# EAGLE design CapePowerSupplyModule (EAGLE 6.4)
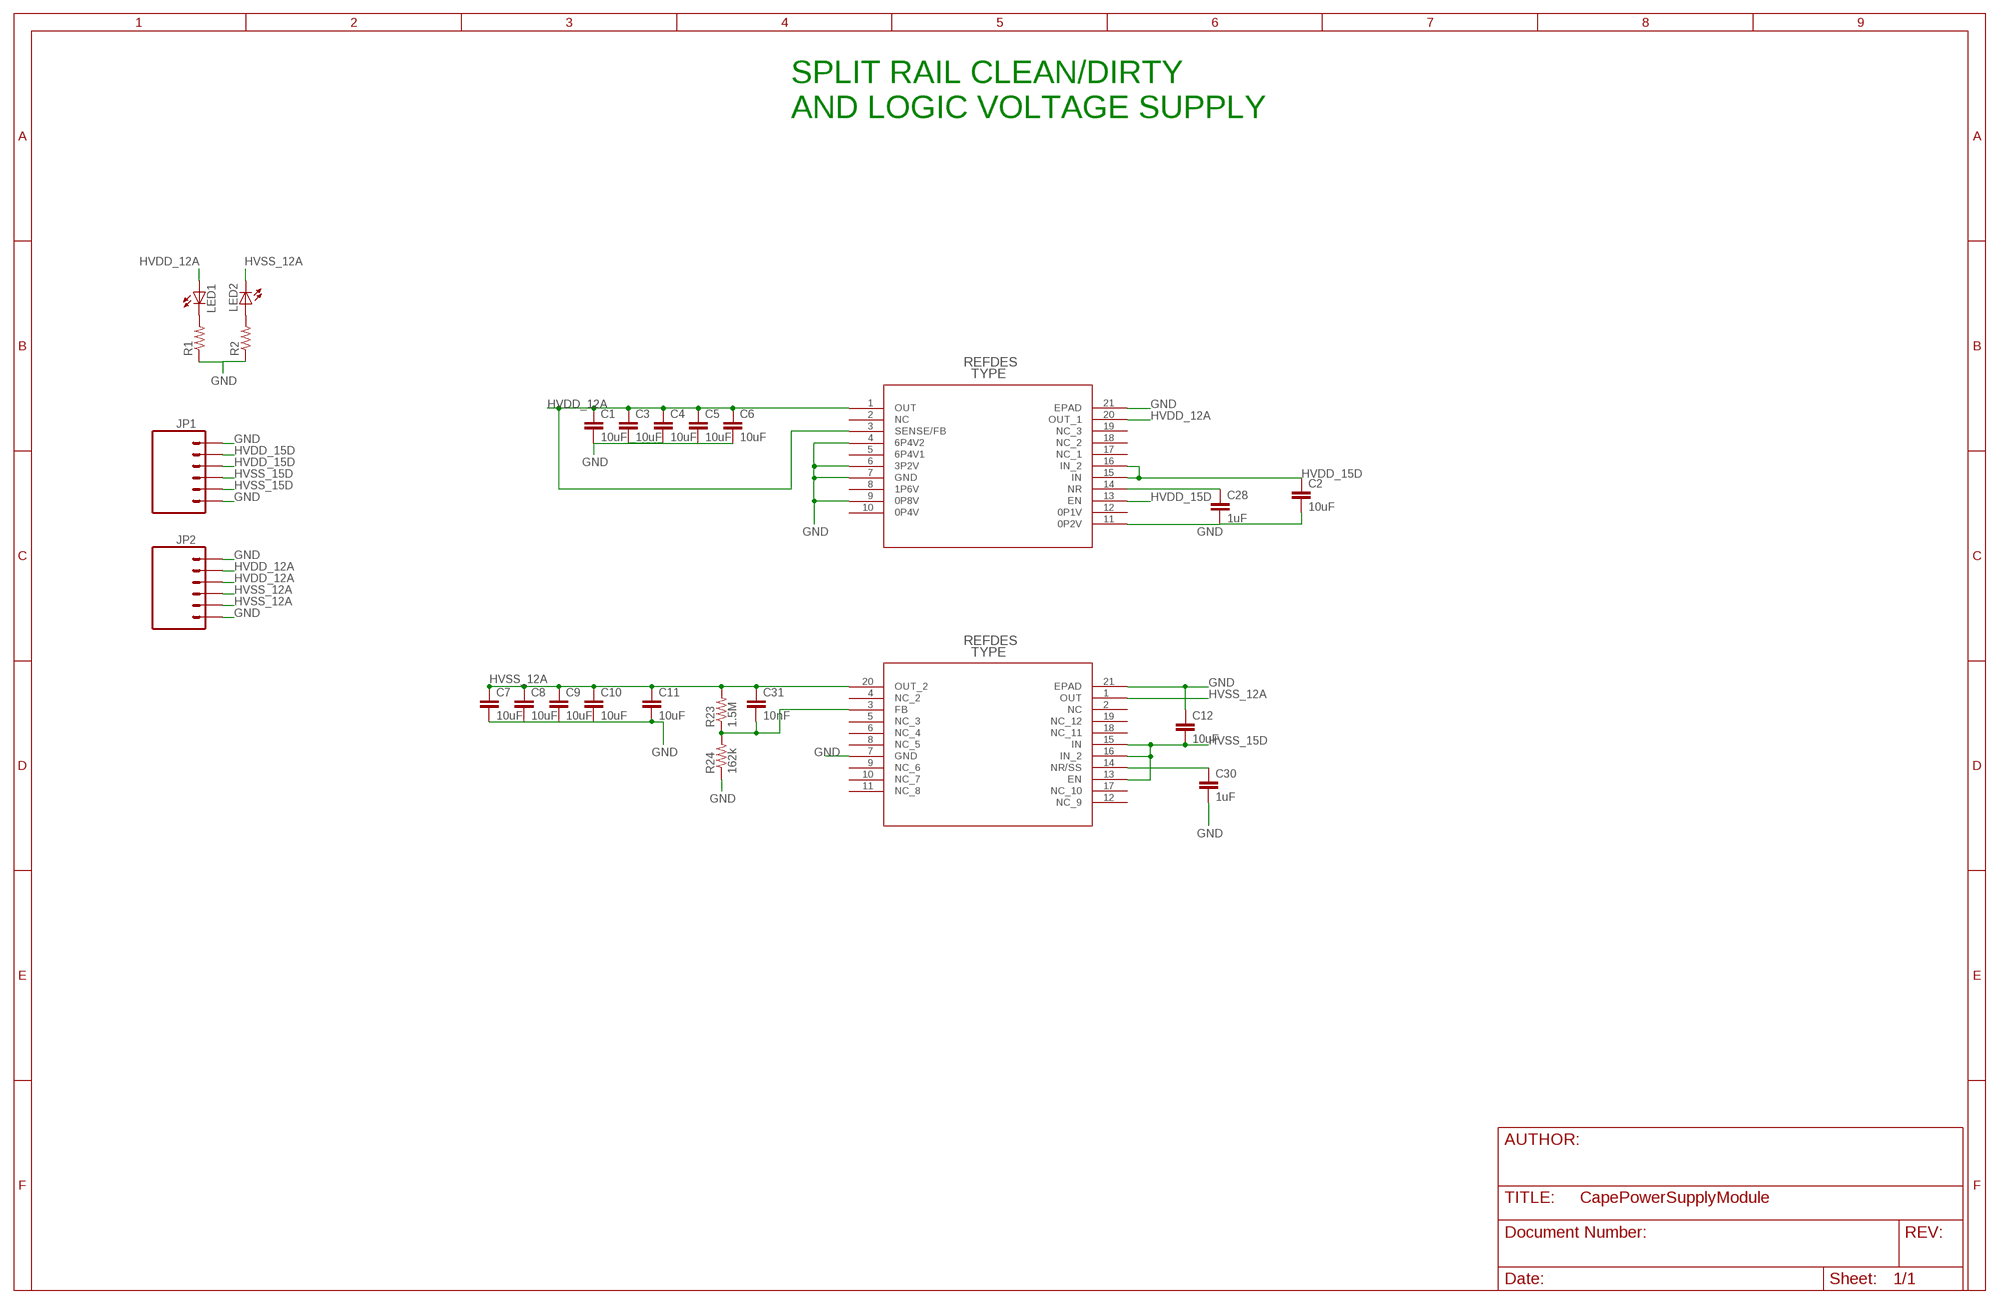
[diagram p0: schematic, sheet 1]

## Parts
C1  10uF  CAP1206  [1206]
C2  10uF  CAP1206  [1206]
C3  10uF  CAP1206  [1206]
C4  10uF  CAP1206  [1206]
C5  10uF  CAP1206  [1206]
C6  10uF  CAP1206  [1206]
C7  10uF  CAP1206  [1206]
C8  10uF  CAP1206  [1206]
C9  10uF  CAP1206  [1206]
C10  10uF  CAP1206  [1206]
C11  10uF  CAP1206  [1206]
C12  10uF  CAP1206  [1206]
C28  1uF  CAP0805  [0805]
C30  1uF  CAP0805  [0805]
C31  10nF  CAP0805  [0805]
JP1  M06LOCK  [1X06_LOCK]
JP2  M06LOCK  [1X06_LOCK]
LED1  LED1206  [LED-1206]
LED2  LED1206  [LED-1206]
R1  RESISTOR0805-RES  [0805]
R2  RESISTOR0805-RES  [0805]
R23  1.5M  RESISTOR0805-RES  [0805]
R24  162k  RESISTOR0805-RES  [0805]
U6  TPS7A3301_RGW_20  [RGW20_3P15X3P15]
U$3  TPS7A4700_RGW_20  [RGW20_3P15X3P15]

## Nets
GND: C1.2 C2.2 C3.2 C4.2 C5.2 C6.2 C7.2 C8.2 C9.2 C10.2 C11.2 C12.1 C28.2 C30.2 JP1.1 JP1.6 JP2.1 JP2.6 R1.1 R2.1 R24.1 U6.7(GND) U6.21(EPAD) U$3.4(6P4V2) U$3.6(3P2V) U$3.7(GND) U$3.9(0P8V) U$3.11(0P2V) U$3.21(EPAD)
HVDD_12A: C1.1 C3.1 C4.1 C5.1 C6.1 JP2.2 JP2.3 LED1.A U$3.1(OUT) U$3.3(SENSE/FB) U$3.20(OUT_1)
HVDD_15D: C2.1 JP1.2 JP1.3 U$3.13(EN) U$3.15(IN) U$3.16(IN_2)
HVSS_12A: C7.1 C8.1 C9.1 C10.1 C11.1 C31.1 JP2.4 JP2.5 LED2.C R23.2 U6.1(OUT) U6.20(OUT_2)
HVSS_15D: C12.2 JP1.4 JP1.5 U6.13(EN) U6.15(IN) U6.16(IN_2)
N$1: LED1.C R1.2
N$2: LED2.A R2.2
N$16: C31.2 R23.1 R24.2 U6.3(FB)
N$33: C30.1 U6.14(NR/SS)
N$45: C28.1 U$3.14(NR)
Unconnected: U6.2(NC) U6.4(NC_2) U6.5(NC_3) U6.6(NC_4) U6.8(NC_5) U6.9(NC_6) U6.10(NC_7) U6.11(NC_8) U6.12(NC_9) U6.17(NC_10) U6.18(NC_11) U6.19(NC_12) U$3.2(NC) U$3.5(6P4V1) U$3.8(1P6V) U$3.10(0P4V) U$3.12(0P1V) U$3.17(NC_1) U$3.18(NC_2) U$3.19(NC_3)

## Notes on the sheet
- SPLIT RAIL CLEAN/DIRTY
  AND LOGIC VOLTAGE SUPPLY

## Library data of the parts
C1-C12 C28 C30 C31 = SensorCape:CAP: Capacitor Standard 0603 ceramic capacitor, and 0.1" leaded capacitor.
JP1 JP2 = ASL:M06: Header 6 Standard 6-pin 0.1" header. Use with straight break away headers (SKU : PRT-00116), right angle break away headers (PRT-00553), swiss pins (PRT-00743), machine pins (PRT-00117), and female headers (PRT-00115). Molex polarized connector foot print use with SKU : PRT-08094 with associated crimp pins and housings. NOTES ON THE VARIANTS LOCK and LOCK_LONGPADS... This footprint was designed to help hold the alignment of a through-hole component (i.e. 6-pin header) while soldering it into place. You may notice that each hole has been shifted either up or down by 0.005 of an inch from it's more standard position (which is a perfectly straight line). This slight alteration caused the pins (the squares in the middle) to touch the edges of the holes. Because they are alternating, it causes a "brace" to hold the component in place. 0.005 has proven to be the perfect amount of "off-center" position when using our standard breakaway headers. Although looks a little odd when you look at the bare footprint, once you have a header in there, the alteration is very hard to notice. Also, if you push a header all the way into place, it is covered up entirely on the bottom side. This idea of altering the position of holes to aid alignment will be further integrated into the Sparkfun Library for other footprints. It can help hold any component with 3 or more connection pins.
LED1 LED2 = ASL:LED: LEDs Standard schematic elements and footprints for 5mm, 3mm, 1206, and 0603 sized LEDs. 5mm - Spark Fun Electronics SKU : COM-00529 (and others)
R1 R2 = SensorCape:RESISTOR: Resistor Basic schematic elements and footprints for 0603, 1206, and PTH resistors.
R23 R24 = ASL:RESISTOR: Resistor Basic schematic elements and footprints for 0603, 1206, and PTH resistors.
U6 = SensorCape:TPS7A3301_RGW_20
U$3 = SensorCape:TPS7A4700_RGW_20

## Board
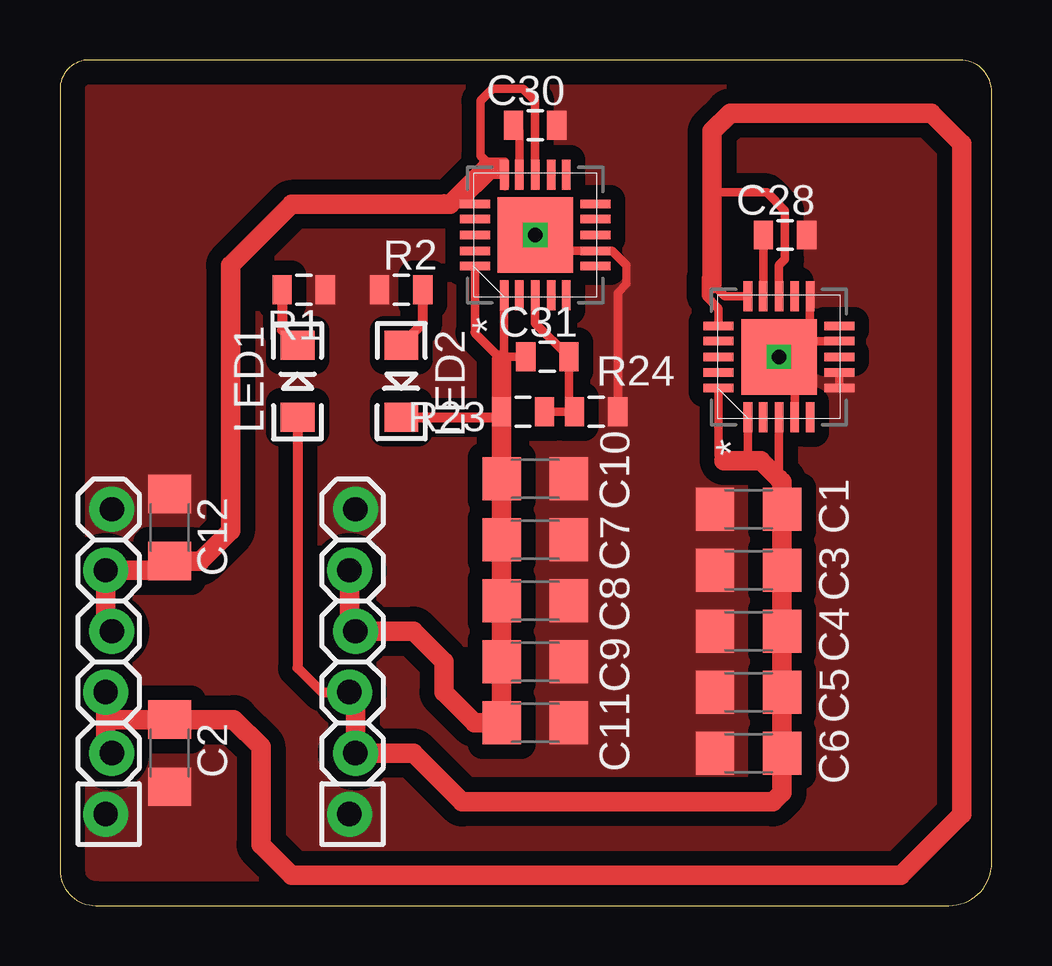
[diagram p1: board, top side]
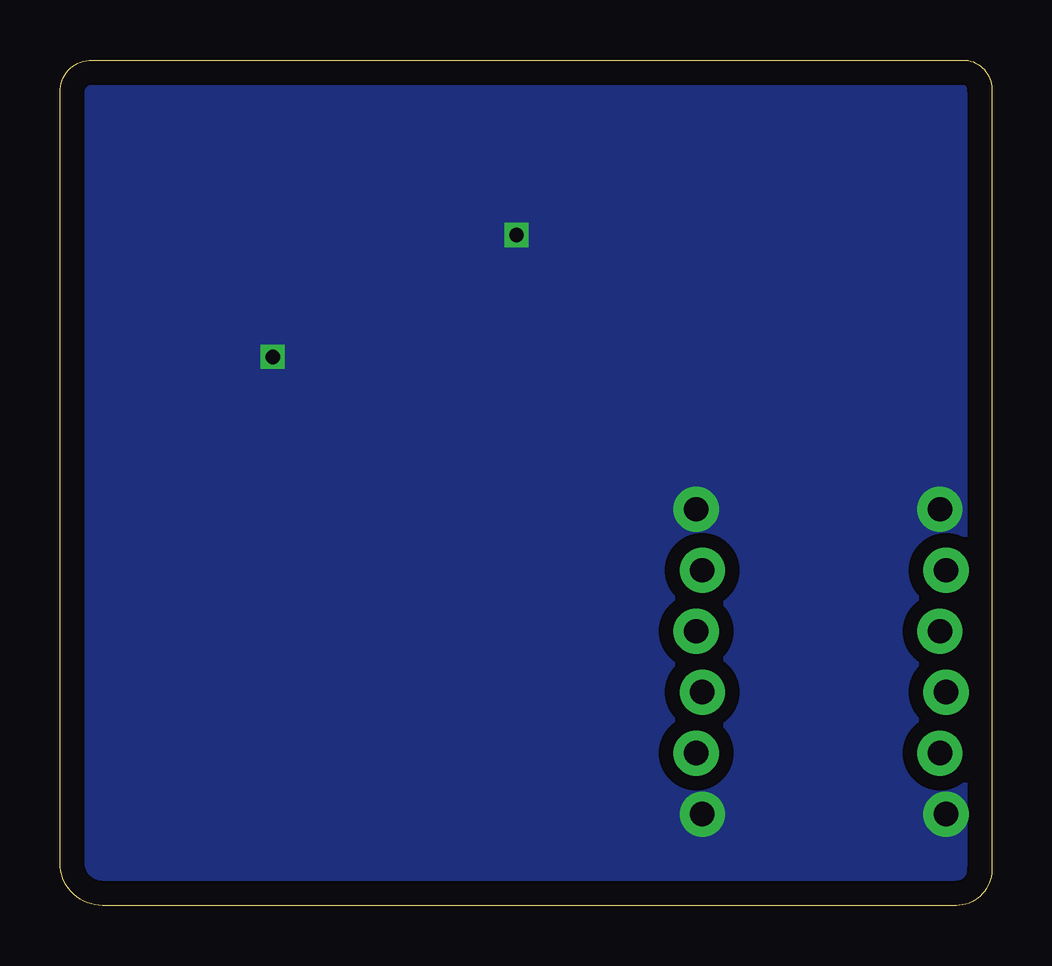
[diagram p2: board, bottom side, seen from below]

Size 38.84 x 35.23 mm. Coordinates in mm from the lower left corner, seen from the top.
Outline: 0,34.02 0,1.48 arc90 1.48,0 37.06,0 arc90 38.84,1.78 38.84,33.9 arc90 37.51,35.23 1.21,35.23 arc90 0,34.02
Copper layers (1*16): Top 0.035mm / dielectric 1.5mm / Bottom 0.035mm
Design rules "default": minimum track width 10mil, minimum drill 24mil, track to track 8mil, track to pad 8mil, pad to pad 8mil, via to via 8mil, smd to smd 8mil, copper to edge 40mil, drill to drill 8mil, minimum pad ring 10mil, minimum via ring 8mil, stop-mask expansion 4mil, vias tented up to drill 0mil, thermal gap 10mil

### Footprints (pad centres in the part's own frame; a part is rotated, then mirrored left to right if it is on the bottom)
1206 = smd 1.6 x 1.8: 1 -1.4,0; 2 1.4,0
0805 = smd 0.8 x 1.2: 1 -0.9,0; 2 0.9,0
1X06_LOCK = drill 1.016 pad 1.88: 1 0,0.127; 2 2.54,-0.127; 3 5.08,0.127; 4 7.62,-0.127; 5 10.16,0.127; 6 12.7,-0.127
LED-1206 = smd 1.2 x 1.4: A -1.5,0; C 1.5,0
RGW20_3P15X3P15 = smd 1.25 x 0.356: 1 -2.518,1.295; 2 -2.518,0.66; 3 -2.518,0; 4 -2.518,-0.66; 5 -2.518,-1.295; 11 2.518,-1.295; 12 2.518,-0.66; 13 2.518,0; 14 2.518,0.66; 15 2.518,1.295 | smd 0.356 x 1.25: 6 -1.295,-2.518; 7 -0.66,-2.518; 8 0,-2.518; 9 0.66,-2.518; 10 1.295,-2.518; 16 1.295,2.518; 17 0.66,2.518; 18 0,2.518; 19 -0.66,2.518; 20 -1.295,2.518 | smd 3.15 x 3.15: 21 0,0

### Placement (x,y rotation side)
C1  28.7,16.51 180 top
C2  4.57,6.35 270 top
C3  28.7,13.97 180 top
C4  28.7,11.43 180 top
C5  28.7,8.89 180 top
C6  28.7,6.35 180 top
C7  19.81,15.24 0 top
C8  19.81,12.7 0 top
C9  19.81,10.16 0 top
C10  19.81,17.78 0 top
C11  19.81,7.62 0 top
C12  4.57,15.75 270 top
C28  30.23,27.94 0 top
C30  19.81,32.51 0 top
C31  20.32,22.86 0 top
JP1  2.03,3.81 90 top
JP2  12.19,3.81 90 top
LED1  9.91,21.84 90 top
LED2  14.22,21.84 270 top
R1  10.16,25.65 180 top
R2  14.22,25.65 0 top
R23  19.3,20.57 180 top
R24  22.35,20.57 180 top
U6  19.81,27.94 90 top
U$3  29.97,22.86 90 top

### Tracks (layer width: path | path; a pad name or v marks a point on that pad's centre or on a via)
GND  (via drill 0.6)
  Top 0.356: R24.1 23.25,25.54 23.62,25.91 23.62,26.67 23.01,27.28 U6.7 20.47,27.28 U6.21 | U$3.11 31.27,24.16 31.24,24.13 31.24,22.86 U$3.21 | U$3.9 30.63,23.52 U$3.21 | U$3.7 U$3.6 | U$3.4 30.63,22.2 U$3.21
  other vias: 19.81,27.94 29.97,22.86
  pour Top (isolate 0.61, no thermals): 38.86,0 -0.25,0 -0.25,35.56 38.86,35.56
  pour Bottom (isolate 0.61, no thermals): 38.86,0 -0.25,0 -0.25,35.56 38.86,35.56
HVDD_12A
  Top 0.356: U$3.20 27.45,18.77 27.69,18.54 | U$3.1 28.68,18.57 28.7,18.54 | U$3.3 29.97,17.78
  Top 0.406: LED1.A 9.91,9.91 10.92,8.89 JP2.3
  Top 0.813: 27.69,18.54 28.7,18.54 29.21,18.54 29.97,17.78 30.1,17.65 C1.1 C3.1 C4.1 C5.1 C6.1 30.1,4.7 29.72,4.32 16.76,4.32 14.73,6.35 JP2.2 12.32,8.64 JP2.3
HVDD_15D
  Top 0.356: U$3.15 27.71,25.38 27.18,25.91 | U$3.16 27.45,24.87 26.92,25.4 26.92,26.16 27.18,26.42 | U$3.13 29.97,26.67 30.23,26.92 30.23,28.96 29.46,29.72 27.43,29.72 27.18,29.46
  Top 0.813: JP1.3 1.91,7.62 | 1.91,7.62 1.91,6.6 JP1.2 | 1.91,7.62 2.04,7.75 C2.1 7.24,7.75 8.38,6.61 8.38,2.54 9.65,1.27 35.05,1.27 37.59,3.81 37.59,31.75 36.32,33.02 27.94,33.02 27.18,32.26 27.18,29.46 27.18,26.42 27.18,25.91
HVSS_12A
  Top 0.356: U6.1 18.52,22.84 | 18.52,22.84 18.41,22.74 17.29,23.85 17.29,23.9 | C31.1 18.54,22.86 18.52,22.84 | U6.20 17.29,23.9 | 17.29,23.9 17.27,23.88
  Top 0.406: LED2.C 18.17,20.34 R23.2
  Top 0.813: 18.41,20.57 C10.1 C7.1 C8.1 C9.1 C11.1 17.27,7.62 16,8.89 16,10.16 14.73,11.43 JP2.4 12.06,11.68 JP2.5 | 18.41,20.57 R23.2 | 18.41,20.57 18.41,22.74
HVSS_15D
  Top 0.356: U6.16 16.76,29.23 | 16.76,29.23 16.23,29.23 | 16.23,29.23 16,29.46 | 16.76,29.23 17.99,30.46 U6.15 18.52,30.5 18.29,30.73 17.78,30.73 | 17.78,30.73 17.78,30.48 16.76,29.46 16.26,29.46 | 16.26,29.21 16.23,29.23 | 17.78,30.73 17.78,30.99 | 17.78,30.99 18.54,30.99 18.54,29.97 | U6.13 19.81,33.53 19.3,34.04 18.03,34.04 17.53,33.53 17.53,31.24 17.78,30.99
  Top 0.813: JP1.4 1.91,11.43 JP1.5 4.57,13.97 C12.2 5.84,14.35 7.11,15.62 7.11,26.67 9.65,29.21 16.26,29.21 17.78,30.73
N$1
  Top 0.406: R1.2 9.26,23.99 LED1.C
N$2
  Top 0.406: R2.2 15.12,24.24 LED2.A
N$16
  Top 0.356: U6.3 19.81,24.27 C31.2 21.22,20.81 R24.2 R23.1
N$33
  Top 0.356: U6.14 19.15,32.27 C30.1
N$45
  Top 0.356: C28.1 29.33,25.39 U$3.14